# EAGLE schematic schematics (EAGLE 6.5.0)
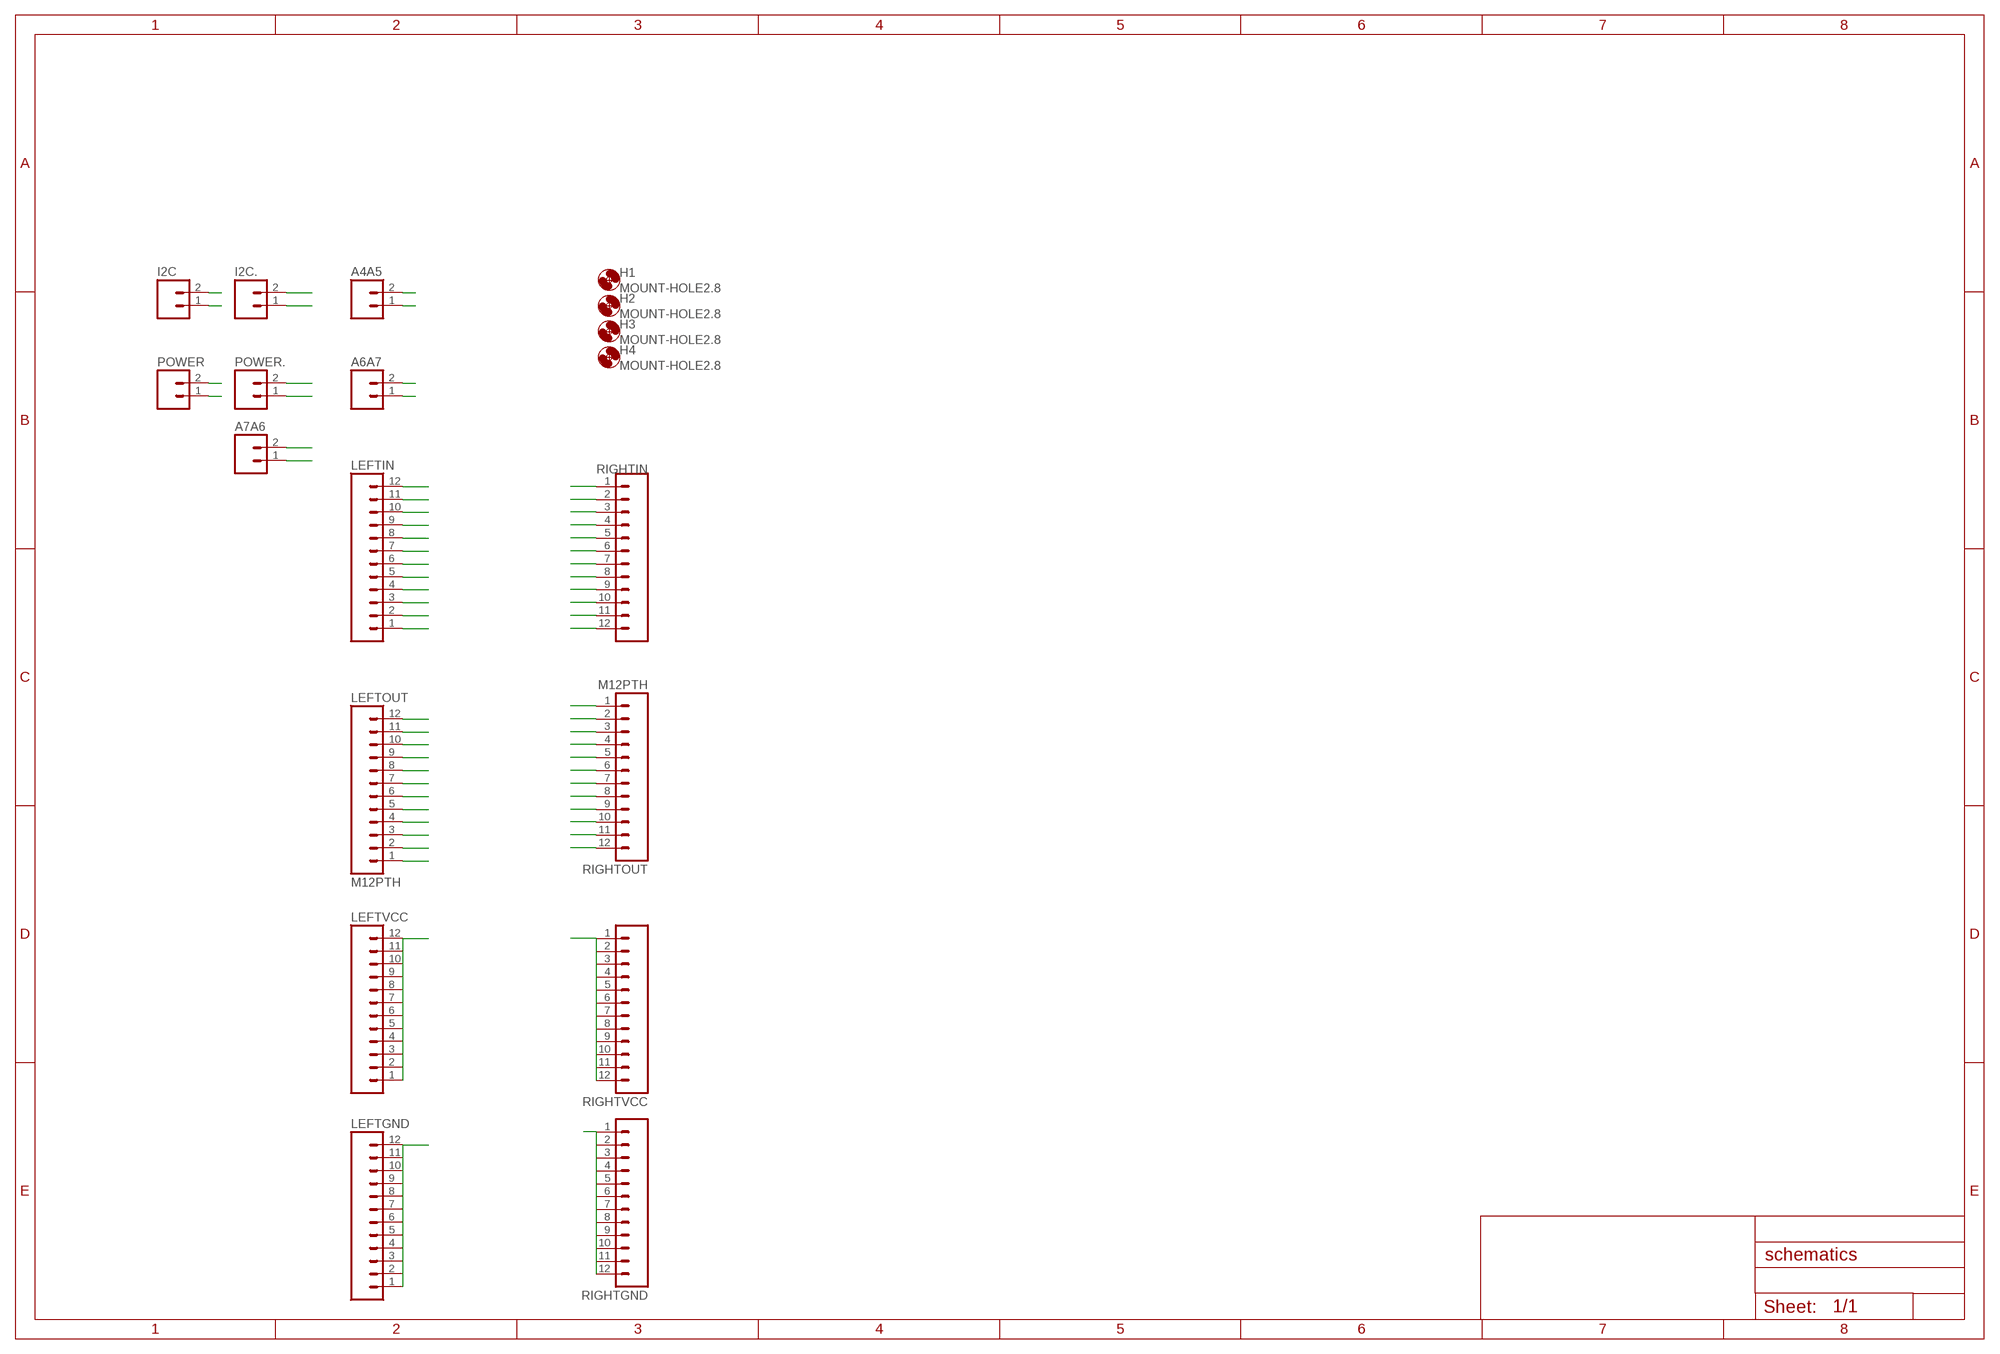
[diagram p0: schematic, sheet 1]

## Parts
A4A5  M02PTH  [1X02]
A6A7  M02PTH  [1X02]
A7A6  M02PTH  [1X02]
H1  MOUNT-HOLE2.8  [2,8]
H2  MOUNT-HOLE2.8  [2,8]
H3  MOUNT-HOLE2.8  [2,8]
H4  MOUNT-HOLE2.8  [2,8]
I2C  M023.5MM  [SCREWTERMINAL-3.5MM-2]
I2C.  M02PTH  [1X02]
LEFTGND  M12PTH  [1X12]
LEFTIN  M12PTH  [1X12]
LEFTOUT  M12PTH  [1X12]
LEFTVCC  M12PTH  [1X12]
POWER  M023.5MM  [SCREWTERMINAL-3.5MM-2]
POWER.  M02PTH  [1X02]
RIGHTGND  M12PTH  [1X12]
RIGHTIN  M12PTH  [1X12]
RIGHTOUT  M12PTH  [1X12]
RIGHTVCC  M12PTH  [1X12]

## Nets
2: LEFTIN.8 LEFTOUT.8
3: LEFTIN.7 LEFTOUT.7
4: LEFTIN.6 LEFTOUT.6
5: LEFTIN.5 LEFTOUT.5
6: LEFTIN.4 LEFTOUT.4
7: LEFTIN.3 LEFTOUT.3
8: LEFTIN.2 LEFTOUT.2
9: LEFTIN.1 LEFTOUT.1
10: RIGHTIN.12 RIGHTOUT.1
11: RIGHTIN.11 RIGHTOUT.2
12: RIGHTIN.10 RIGHTOUT.3
13: RIGHTIN.9 RIGHTOUT.4
A0: RIGHTIN.8 RIGHTOUT.5
A1: RIGHTIN.7 RIGHTOUT.6
A2: RIGHTIN.6 RIGHTOUT.7
A3: RIGHTIN.5 RIGHTOUT.8
A4SDA: A4A5.1 I2C.1 I2C..1
A5SCL: A4A5.2 I2C.2 I2C..2
A6: A6A7.1 A7A6.1
A7: A6A7.2 A7A6.2
GND: LEFTGND.1 LEFTGND.2 LEFTGND.3 LEFTGND.4 LEFTGND.5 LEFTGND.6 LEFTGND.7 LEFTGND.8 LEFTGND.9 LEFTGND.10 LEFTGND.11 LEFTGND.12 LEFTIN.9 LEFTOUT.9 POWER.1 POWER..1 RIGHTGND.1 RIGHTGND.2 RIGHTGND.3 RIGHTGND.4 RIGHTGND.5 RIGHTGND.6 RIGHTGND.7 RIGHTGND.8 RIGHTGND.9 RIGHTGND.10 RIGHTGND.11 RIGHTGND.12 RIGHTIN.2 RIGHTOUT.11
RAW: RIGHTOUT.12
RST: LEFTIN.10 LEFTOUT.10 RIGHTIN.3 RIGHTOUT.10
RX: LEFTIN.11 LEFTOUT.11
TX: LEFTIN.12 LEFTOUT.12
VCC: LEFTVCC.1 LEFTVCC.2 LEFTVCC.3 LEFTVCC.4 LEFTVCC.5 LEFTVCC.6 LEFTVCC.7 LEFTVCC.8 LEFTVCC.9 LEFTVCC.10 LEFTVCC.11 LEFTVCC.12 RIGHTIN.4 RIGHTOUT.9 RIGHTVCC.1 RIGHTVCC.2 RIGHTVCC.3 RIGHTVCC.4 RIGHTVCC.5 RIGHTVCC.6 RIGHTVCC.7 RIGHTVCC.8 RIGHTVCC.9 RIGHTVCC.10 RIGHTVCC.11 RIGHTVCC.12
VIN: POWER.2 POWER..2 RIGHTIN.1

## Library data of the parts
A4A5 A6A7 A7A6 I2C I2C. POWER POWER. = SparkFun-Connectors:M02: Standard 2-pin 0.1" header. Use with - straight break away headers ( PRT-00116) - right angle break away headers (PRT-00553) - swiss pins (PRT-00743) - machine pins (PRT-00117) - female headers (PRT-00115) Molex polarized connector foot print use with: PRT-08233 with associated crimp pins and housings. 2.54_SCREWTERM for use with PRT-10571. 3.5mm Screw Terminal footprints for PRT-08084 5mm Screw Terminal footprints for use with PRT-08433
H1-H4 = holes:MOUNT-HOLE: MOUNTING HOLE with drill center marker
LEFTGND LEFTIN LEFTOUT LEFTVCC RIGHTGND RIGHTIN RIGHTOUT RIGHTVCC = SparkFun-Connectors:M12: Header 12 Standard 12-pin 0.1" header. Use with straight break away headers (SKU : PRT-00116), right angle break away headers (PRT-00553), swiss pins (PRT-00743), machine pins (PRT-00117), and female headers (PRT-00115).